# Altium schematic sheet B38_ACtoDC.SchDoc
size A4
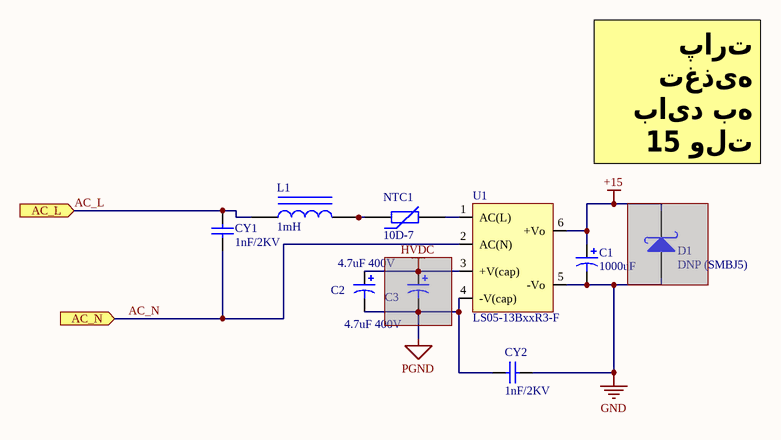
[diagram p0: B38_ACtoDC.SchDoc]

## Parts
C1  1000uF  [Cap electrolitic radial 8x11.5]
C2  4.7uF 400V  [Cap electrolitic radial 8x11.5]
C3  4.7uF 400V  [Cap electrolitic radial 8x11.5]  (masked out: inside a compile mask, not in the netlist)
CY1  1nF/2KV  [NTC 7.5-D]
CY2  1nF/2KV  [NTC 7.5-D]
D1  DNP (SMBJ5)  [DO-214]  (masked out: inside a compile mask, not in the netlist)
L1  1mH  [Inductor Stand]
NTC1  10D-7  [NTC 7.5-D]
U1  LS05-13BxxR3-F  [LS05-13BxxR3]

## Ports
AC_L (in), AC_N (in)

## Nets
+15: C1.1 U1.6(+Vo)
GND: C1.2 CY2.2 U1.5(-Vo)
PGND: C2.2 CY2.1 U1.4(-V(cap))
AC_L: CY1.2 L1.1 ; port AC_L
AC_N: CY1.1 U1.2(AC(N)) ; port AC_N
NetC2_1: C2.1 U1.3(+V(cap))
NetL1_2: L1.2 NTC1.1
NetNTC1_2: NTC1.2 U1.1(AC(L))

## Notes on the sheet
- پارت تغذیه باید به 15 ولت تغییر بکنه

## Library data of the parts
C1 = Cap Pol1: Aluminum electrolytic capacitor  22uF/450V/Φ12.5*20; Value: 1000uF
C2 C3 = Cap Pol1: Aluminum electrolytic capacitor  4.7uF/400V/Φ8*11.5; Value: 4.7uF 400V
CY1 CY2 = CAP SMD PACKAGE: Capacitor 2KV/10%; Manufacturer: Walsin; PN: C1206X102KGRACAUTO; VALUE: 1nF/2KV
D1 = 1N5822 SMD: TVS Diode 5V; Manufacturer: LittelFuse; PN: SMBJ5.0A; Value: SMBJ5.0A
L1 = Inductor Iron: 4.7mH/15Ω/0.1A; Value: 1mH
NTC1 = Res Varistor: Varistor (Voltage-Sensitive Resistor); Code_IPC: 10R 1A